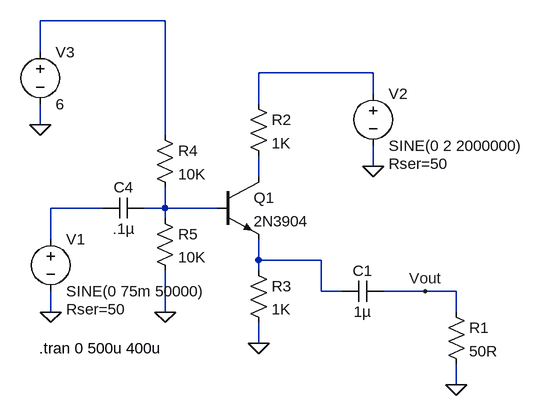
[diagram p0: schematic Modulator 2.asc]
Modulator 2.asc, the LTspice schematic file:
Version 4
SHEET 1 880 680
WIRE 64 -176 -128 -176
WIRE -128 -128 -128 -176
WIRE 384 -96 208 -96
WIRE 384 -64 384 -96
WIRE 208 -48 208 -96
WIRE -128 -16 -128 -48
WIRE 64 0 64 -176
WIRE 384 48 384 16
WIRE 208 64 208 32
WIRE -32 112 -112 112
WIRE 64 112 64 80
WIRE 64 112 32 112
WIRE 144 112 64 112
WIRE 64 128 64 112
WIRE -112 160 -112 112
WIRE 208 192 208 160
WIRE 304 192 208 192
WIRE 208 208 208 192
WIRE 304 240 304 192
WIRE 336 240 304 240
WIRE 464 240 400 240
WIRE 512 240 464 240
WIRE -112 272 -112 240
WIRE 64 272 64 208
WIRE 512 272 512 240
WIRE 208 320 208 288
WIRE 512 384 512 352
FLAG -112 272 0
FLAG 384 48 0
FLAG 464 240 Vout
FLAG 512 384 0
FLAG 208 320 0
FLAG 64 272 0
FLAG -128 -16 0
SYMBOL voltage -112 144 R0
WINDOW 123 0 0 Left 2
WINDOW 39 24 124 Left 2
SYMATTR InstName V1
SYMATTR Value SINE(0 75m 50000)
SYMATTR SpiceLine Rser=50
SYMBOL voltage 384 -80 R0
WINDOW 123 0 0 Left 2
WINDOW 39 24 124 Left 2
SYMATTR InstName V2
SYMATTR Value SINE(0 2 2000000)
SYMATTR SpiceLine Rser=50
SYMBOL cap 32 96 R90
WINDOW 0 0 32 VBottom 2
WINDOW 3 32 32 VTop 2
SYMATTR InstName C4
SYMATTR Value .1µ
SYMBOL res 496 256 R0
SYMATTR InstName R1
SYMATTR Value 50R
SYMBOL cap 400 224 R90
WINDOW 0 0 32 VBottom 2
WINDOW 3 32 32 VTop 2
SYMATTR InstName C1
SYMATTR Value 1µ
SYMBOL npn 144 64 R0
SYMATTR InstName Q1
SYMATTR Value 2N3904
SYMBOL res 192 -64 R0
SYMATTR InstName R2
SYMATTR Value 1K
SYMBOL res 192 192 R0
SYMATTR InstName R3
SYMATTR Value 1K
SYMBOL res 48 -16 R0
SYMATTR InstName R4
SYMATTR Value 10K
SYMBOL res 48 112 R0
SYMATTR InstName R5
SYMATTR Value 10K
SYMBOL voltage -128 -144 R0
WINDOW 123 0 0 Left 2
WINDOW 39 24 124 Left 2
SYMATTR InstName V3
SYMATTR Value 6
TEXT -130 328 Left 2 !.tran 0 500u 400u

The netlist it stands for:
* Modulator 2.asc
V1 N004 0 SINE(0 75m 50000) Rser=50
V2 N002 0 SINE(0 2 2000000) Rser=50
C4 N005 N004 .1µ
R1 Vout 0 50R
C1 Vout N006 1µ
Q1 N003 N005 N006 0 2N3904
R2 N002 N003 1K
R3 N006 0 1K
R4 N001 N005 10K
R5 N005 0 10K
V3 N001 0 6
.model NPN NPN
.model PNP PNP
.lib standard.bjt
.tran 0 500u 400u
.backanno
.end